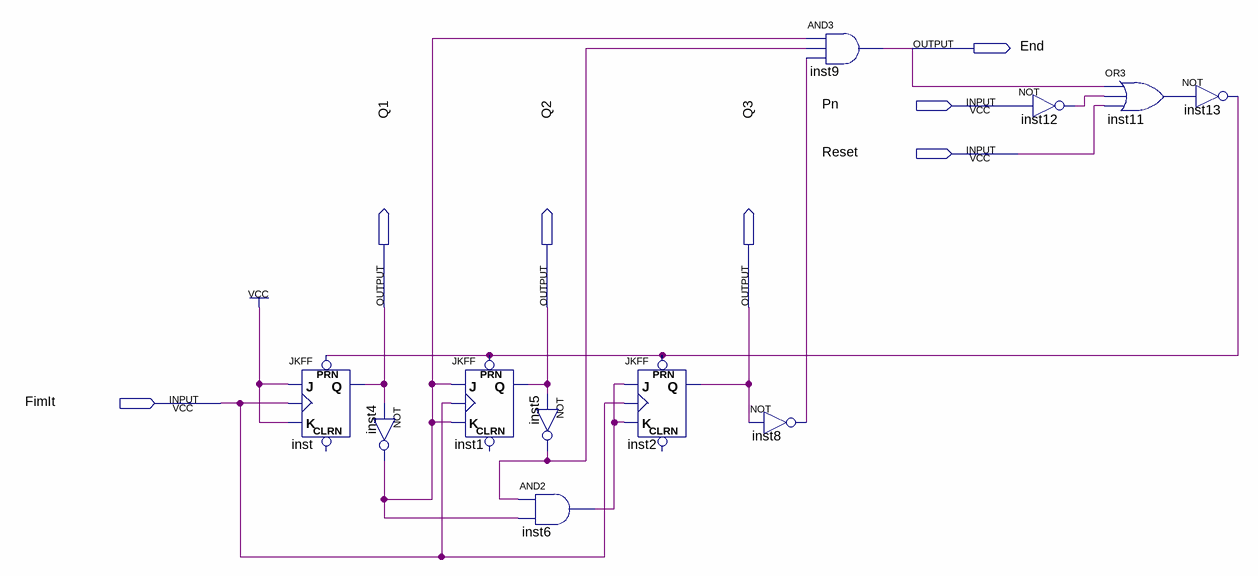
[diagram p0: schematic sheet]
// Quartus schematic ContadorNave.bdf as structural Verilog: 11 symbols, 7 pins
module ContadorNave (
  input  Pn,
  input  Reset,
  input  FimIt,
  output End,
  output Q1,
  output Q2,
  output Q3
);

  wire inst4_out, inst5_out, inst6_out, inst8_out, inst11_out, inst12_out, inst13_out;

  JKFF inst (.PRN(inst13_out), .K(1'b1), .J(1'b1), .CLK(FimIt), .Q(Q1));  // open: CLRN
  not inst4 (inst4_out, Q1);
  JKFF inst1 (.PRN(inst13_out), .K(inst4_out), .J(inst4_out), .CLK(FimIt), .Q(Q2));  // open: CLRN
  not inst5 (inst5_out, Q2);
  and inst6 (inst6_out, inst5_out, inst4_out);
  JKFF inst2 (.PRN(inst13_out), .K(inst6_out), .J(inst6_out), .CLK(FimIt), .Q(Q3));  // open: CLRN
  and inst9 (End, inst4_out, inst5_out, inst8_out);
  not inst8 (inst8_out, Q3);
  not inst12 (inst12_out, Pn);
  or inst11 (inst11_out, End, inst12_out, Reset);
  not inst13 (inst13_out, inst11_out);
endmodule
